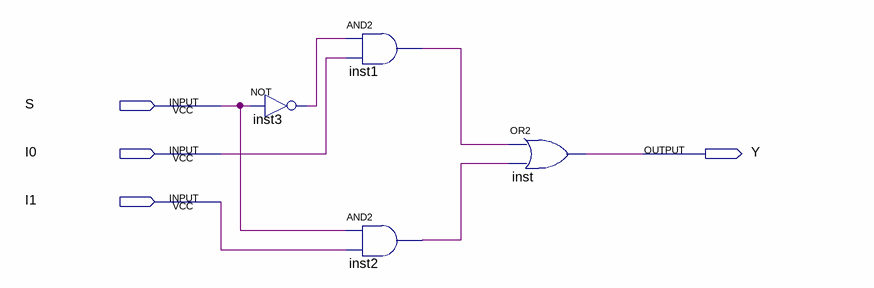
[diagram p0: schematic sheet]
// Quartus schematic mux2to1.bdf as structural Verilog: 4 symbols, 4 pins
module mux2to1 (
  input  S,
  input  I0,
  input  I1,
  output Y
);

  wire inst1_out, inst2_out, inst3_out;

  not inst3 (inst3_out, S);
  and inst1 (inst1_out, inst3_out, I0);
  and inst2 (inst2_out, S, I1);
  or inst (Y, inst1_out, inst2_out);
endmodule
